# EAGLE design schematic (EAGLE 8.4.0)
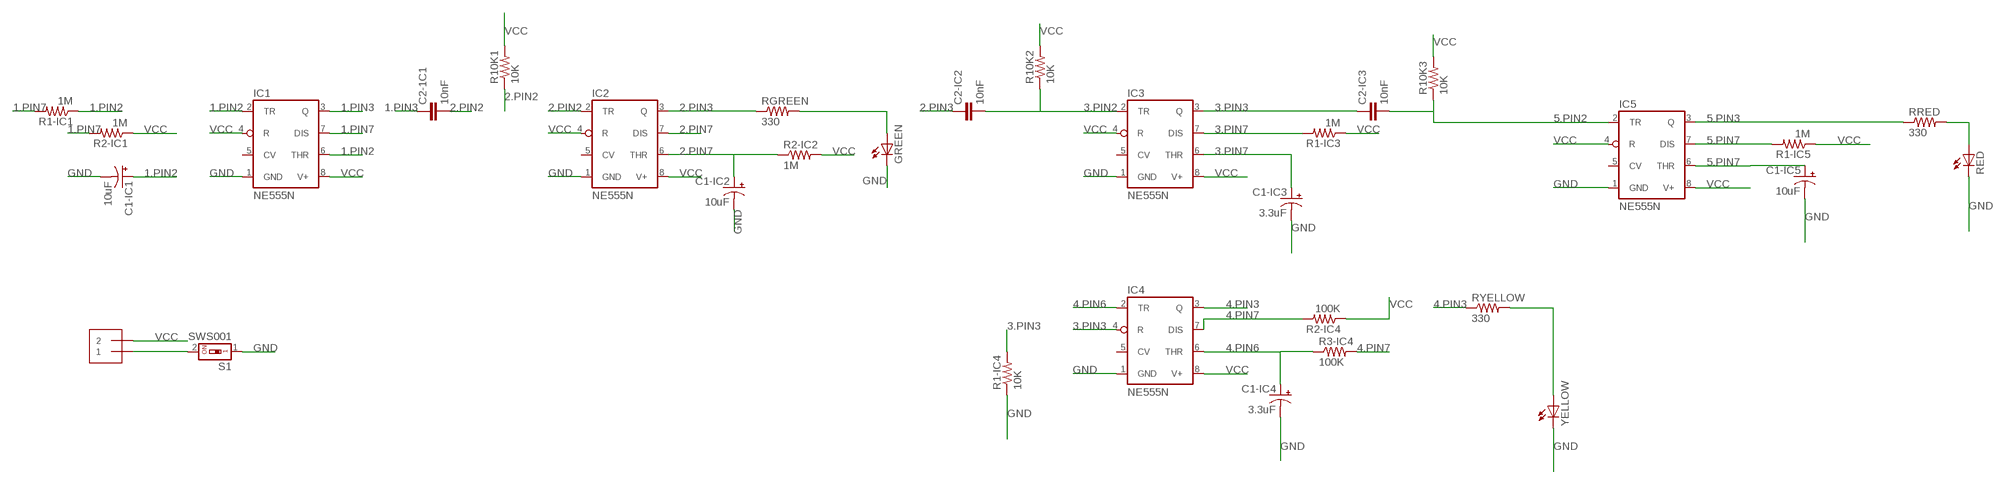
[diagram p0: schematic, sheet 1]

## Parts
C1-IC1  10uF  100UF-POLAR-RADIAL-2.5MM-25V-20%  [CPOL-RADIAL-2.5MM-6.5MM]
C1-IC2  10uF  100UF-POLAR-RADIAL-2.5MM-25V-20%  [CPOL-RADIAL-2.5MM-6.5MM]
C1-IC3  3.3uF  100UF-POLAR-RADIAL-2.5MM-25V-20%  [CPOL-RADIAL-2.5MM-6.5MM]
C1-IC4  3.3uF  100UF-POLAR-RADIAL-2.5MM-25V-20%  [CPOL-RADIAL-2.5MM-6.5MM]
C1-IC5  10uF  100UF-POLAR-RADIAL-2.5MM-25V-20%  [CPOL-RADIAL-2.5MM-6.5MM]
C2-1C1  10nF  10NF-0603-50V-10%  [0603]
C2-IC2  10nF  10NF-0603-50V-10%  [0603]
C2-IC3  10nF  10NF-0603-50V-10%  [0603]
GREEN  LED5MM  [LED5MM]
IC1  NE555N  [DIL08-ROUND]
IC2  NE555N  [DIL08-ROUND]
IC3  NE555N  [DIL08-ROUND]
IC4  NE555N  [DIL08-ROUND]
IC5  NE555N  [DIL08-ROUND]
J1  1X2-3.5MM  [1X2-3.5MM]
R1-IC1  1M  R-US_0204/7  [0204/7]
R1-IC3  1M  R-US_0204/7  [0204/7]
R1-IC4  10K  R-US_0204/7  [0204/7]
R1-IC5  1M  R-US_0204/7  [0204/7]
R2-IC1  1M  R-US_0204/7  [0204/7]
R2-IC2  1M  R-US_0204/7  [0204/7]
R2-IC4  100K  R-US_0204/7  [0204/7]
R3-IC4  100K  R-US_0204/7  [0204/7]
R10K1  10K  R-US_0204/7  [0204/7]
R10K2  10K  R-US_0204/7  [0204/7]
R10K3  10K  R-US_0204/7  [0204/7]
RED  LED5MM  [LED5MM]
RGREEN  330  R-US_0204/7  [0204/7]
RRED  330  R-US_0204/7  [0204/7]
RYELLOW  330  R-US_0204/7  [0204/7]
S1  SWS001  [SMS-001]
YELLOW  LED5MM  [LED5MM]

## Nets
1.PIN2: C1-IC1.1(+) IC1.2(TR) IC1.6(THR) R1-IC1.1
1.PIN3: C2-1C1.1 IC1.3(Q)
1.PIN7: IC1.7(DIS) R1-IC1.2 R2-IC1.2
2.PIN2: C2-1C1.2 IC2.2(TR) R10K1.1
2.PIN3: C2-IC2.1 IC2.3(Q) RGREEN.1
2.PIN7: C1-IC2.1(+) IC2.6(THR) IC2.7(DIS) R2-IC2.1
3.PIN2: C2-IC2.2 IC3.2(TR) R10K2.1
3.PIN3: C2-IC3.1 IC3.3(Q) IC4.4(R) R1-IC4.2
3.PIN7: C1-IC3.1(+) IC3.6(THR) IC3.7(DIS) R1-IC3.2
4.PIN3: IC4.3(Q) RYELLOW.1
4.PIN6: C1-IC4.1(+) IC4.2(TR) IC4.6(THR) R3-IC4.1
4.PIN7: IC4.7(DIS) R2-IC4.2 R3-IC4.2
5.PIN2: C2-IC3.2 IC5.2(TR) R10K3.1
5.PIN3: IC5.3(Q) RRED.1
5.PIN7: C1-IC5.1(+) IC5.6(THR) IC5.7(DIS) R1-IC5.2
GND: C1-IC1.2(-) C1-IC2.2(-) C1-IC3.2(-) C1-IC4.2(-) C1-IC5.2(-) GREEN.K(C) IC1.1(GND) IC2.1(GND) IC3.1(GND) IC4.1(GND) IC5.1(GND) R1-IC4.1 RED.K(C) S1.1 YELLOW.K(C)
GNDBAT: J1.1 S1.2
GREEN: GREEN.A RGREEN.2
RED: RED.A RRED.2
VCC: IC1.4(R) IC1.8(V+) IC2.4(R) IC2.8(V+) IC3.4(R) IC3.8(V+) IC4.8(V+) IC5.4(R) IC5.8(V+) J1.2 R1-IC3.1 R1-IC5.1 R2-IC1.1 R2-IC2.2 R2-IC4.1 R10K1.2 R10K2.2 R10K3.2
YELLOW: RYELLOW.2 YELLOW.A
Unconnected: IC1.5(CV) IC2.5(CV) IC3.5(CV) IC4.5(CV) IC5.5(CV)

## Library data of the parts
C1-IC1-C1-IC5 = SparkFun-Capacitors:100UF-POLAR: 100µF polarized capacitors A capacitor is a passive two-terminal electrical component used to store electrical energy temporarily in an electric field.; PROD_ID: CAP-08439; VALUE: 100uF
C2-1C1 C2-IC2 C2-IC3 = SparkFun-Capacitors:10NF: 0.01uF/10nF/10,000pF ceramic capacitors A capacitor is a passive two-terminal electrical component used to store electrical energy temporarily in an electric field. CAP-09321; PROD_ID: CAP-00867
GREEN RED YELLOW = adafruit:LED: LED OSRAM: - CHIPLED LG R971, LG N971, LY N971, LG Q971, LY Q971, LO R971, LY R971 LH N974, LH R974 LS Q976, LO Q976, LY Q976 LO Q996 - Hyper CHIPLED LW Q18S LB Q993, LB Q99A, LB R99A - SideLED LS A670, LO A670, LY A670, LG A670, LP A670 LB A673, LV A673, LT A673, LW A673 LH A674 LY A675 LS A676, LA A676, LO A676, LY A676, LW A676 LS A679, LY A679, LG A679 - Hyper Micro SIDELED® LS Y876, LA Y876, LO Y876, LY Y876 LT Y87S - SmartLED LW L88C, LW L88S LB L89C, LB L89S, LG L890 LS L89K, LO L89K, LY L89K LS L896, LA L896, LO L896, LY L896 - TOPLED LS T670, LO T670, LY T670, LG T670, LP T670 LSG T670, LSP T670, LSY T670, LOP T670, LYG T670 LG T671, LOG T671, LSG T671 LB T673, LV T673, LT T673, LW T673 LH T674 LS T676, LA T676, LO T676, LY T676, LB T676, LH T676, LSB T676, LW T676 LB T67C, LV T67C, LT T67C, LS T67K, LO T67K, LY T67K, LW E67C LS E67B, LA E67B, LO E67B, LY E67B, LB E67C, LV E67C, LT E67C LW T67C LS T679, LY T679, LG T679 LS T770, LO T770, LY T770, LG T770, LP T770 LB T773, LV T773, LT T773, LW T773 LH T774 LS E675, LA E675, LY E675, LS T675 LS T776, LA T776, LO T776, LY T776, LB T776 LHGB T686 LT T68C, LB T68C - Hyper Mini TOPLED® LB M676 - Mini TOPLED Santana® LG M470 LS M47K, LO M47K, LY M47K Source: http://www.osram.convergy.de/
IC1-IC5 = adafruit:*555: TIMER Changed DIP package to have round (not oval) pin pads http://www.ladyada.net/library/pcb/eaglelibrary.html
J1 = adafruit:1X2: 3.5mm Terminal block http://www.ladyada.net/library/pcb/eaglelibrary.html
R1-IC1 R1-IC3-R1-IC5 R2-IC1 R2-IC2 R2-IC4 R3-IC4 R10K1-R10K3 RGREEN RRED RYELLOW = adafruit:R-US_: RESISTOR, American symbol
S1 = smd-special:SWS001: SMD Dip Switch 1 pol.

## Net classes
0 default: width 0.65 mm, drill 0.3 mm, clearance 0.7 mm

## Board
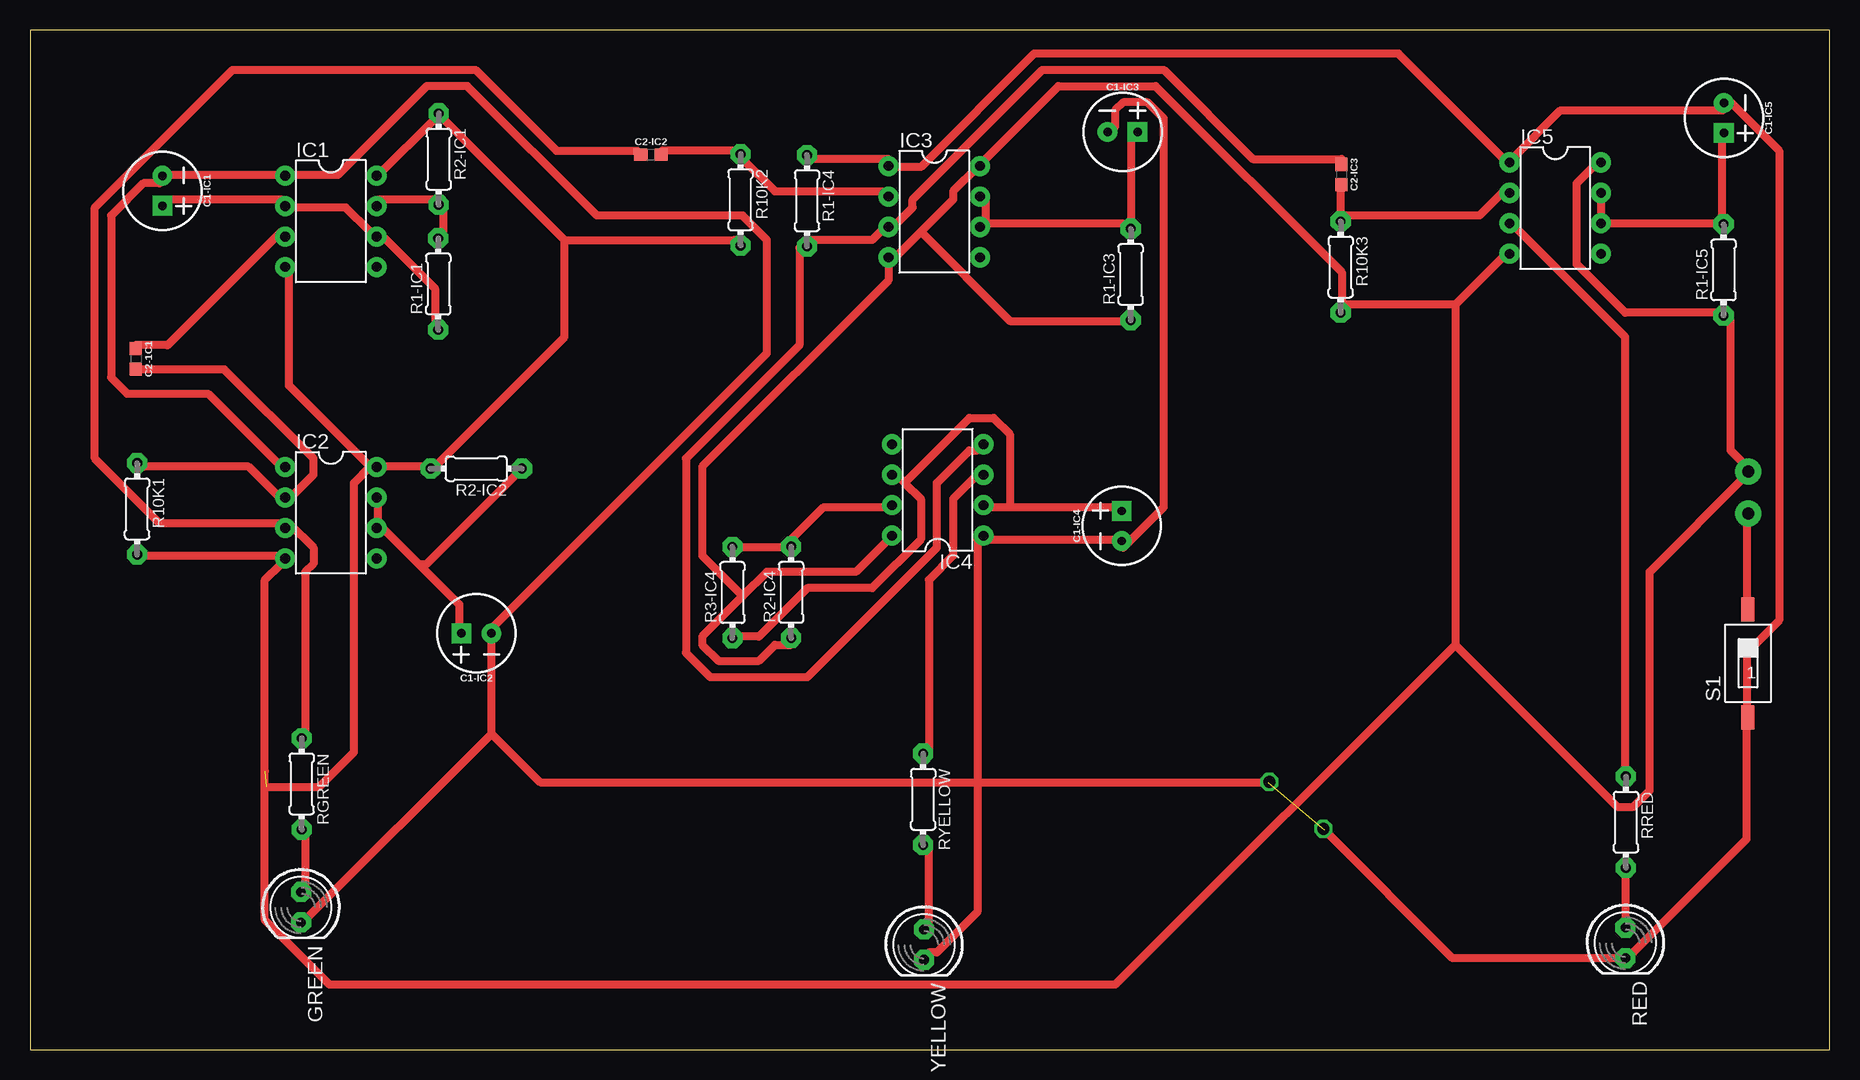
[diagram p1: board, top side]
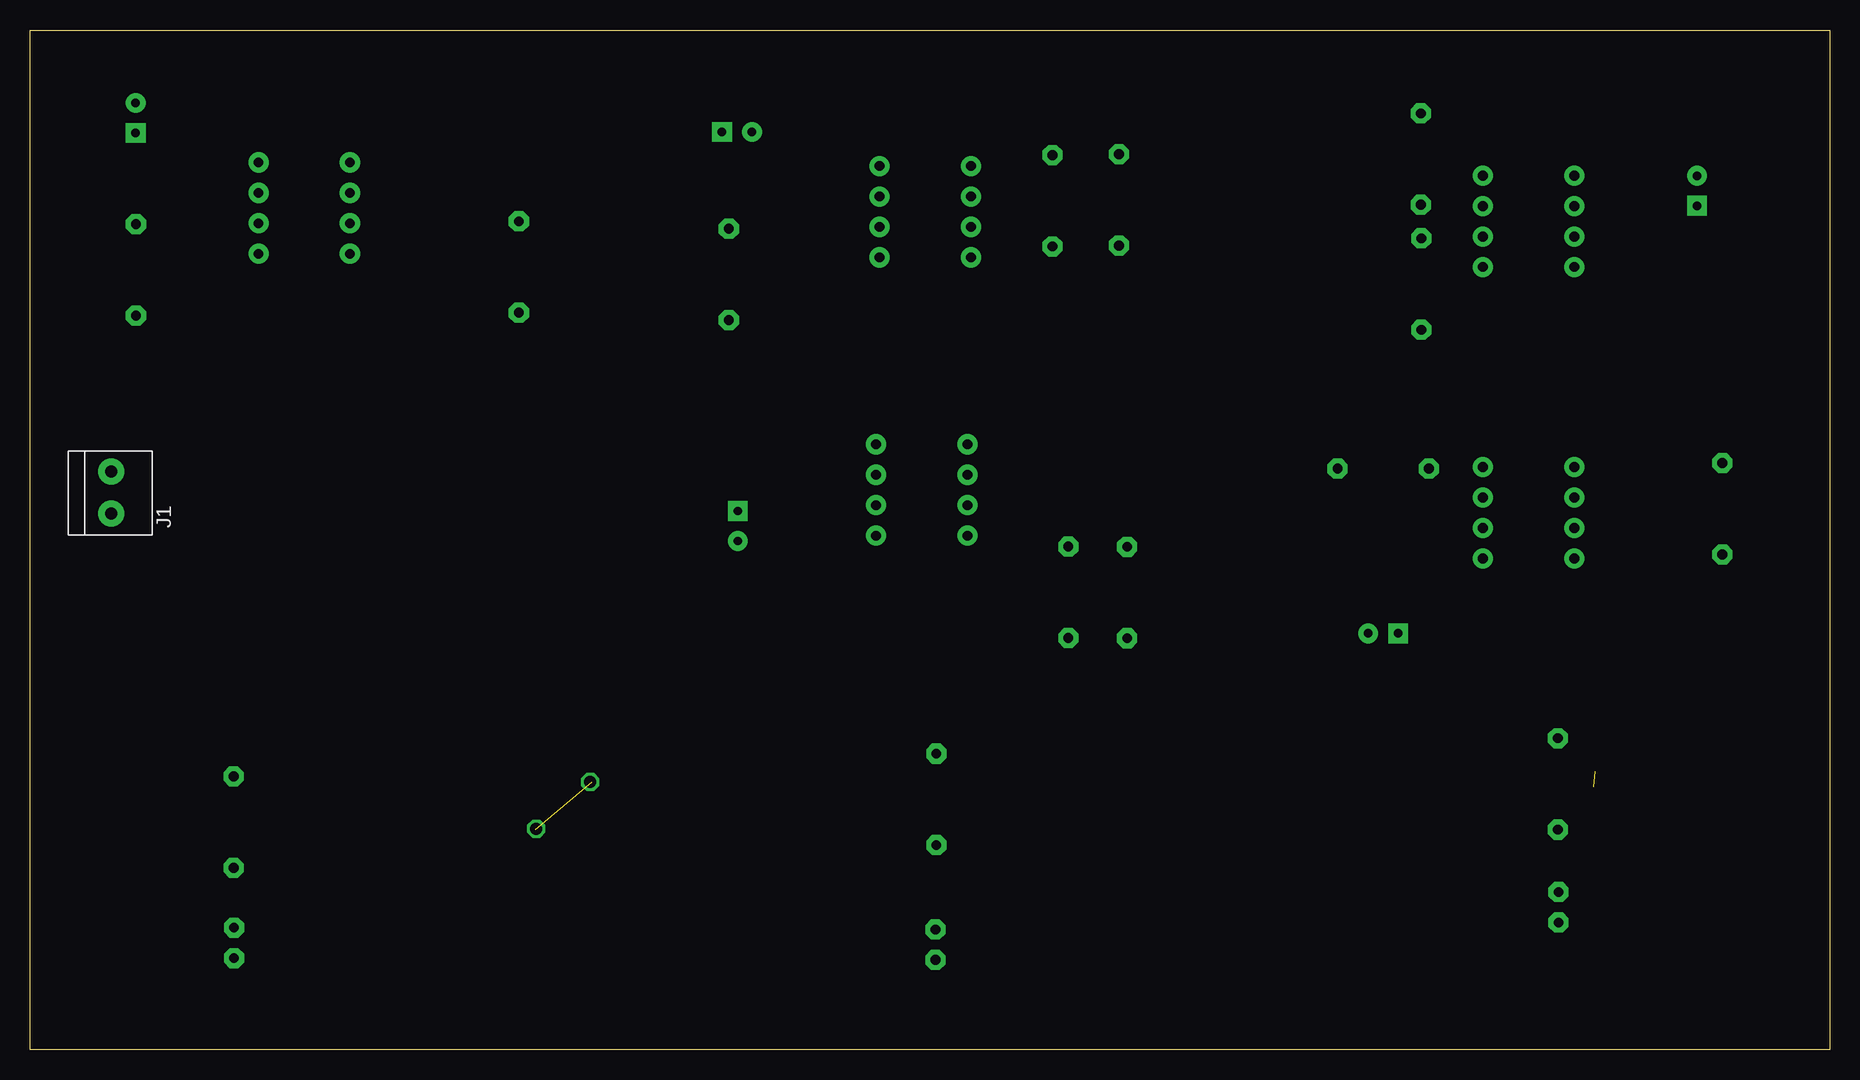
[diagram p2: board, bottom side, seen from below]

Size 150 x 85 mm. Coordinates in mm from the lower left corner, seen from the top.
Outline: 0,0 150,0 150,85 0,85 0,0
Copper layers (1*16): Top 0.035mm / dielectric 1.5mm / Bottom 0.035mm
Design rules "default": minimum track width 6mil, minimum drill 0.35mm, track to track 6mil, track to pad 6mil, pad to pad 6mil, via to via 6mil, smd to smd 6mil, copper to edge 40mil, drill to drill 6mil, minimum pad ring 10mil, minimum via ring 8mil, stop-mask expansion 4mil, vias tented up to drill 0mil, thermal gap 10mil

### Footprints (pad centres in the part's own frame; a part is rotated, then mirrored left to right if it is on the bottom)
CPOL-RADIAL-2.5MM-6.5MM = drill 0.7 pad 1.651 square: 1 1.25,0 | drill 0.7 pad 1.651: 2 -1.25,0
0603 = smd 1.1 x 1: 1 -0.85,0; 2 0.85,0
LED5MM = drill 0.813 pad 1.676 octagon: A -1.27,0; K 1.27,0
DIL08-ROUND = drill 0.813 pad 1.676: 1 -3.81,-3.81; 2 -1.27,-3.81; 3 1.27,-3.81; 4 3.81,-3.81; 5 3.81,3.81; 6 1.27,3.81; 7 -1.27,3.81; 8 -3.81,3.81
1X2-3.5MM = drill 1 pad 2.184: 1 1.8,0; 2 -1.7,0
0204/7 = drill 0.813 pad 1.676 octagon: 1 -3.81,0; 2 3.81,0
SMS-001 = smd 1.092 x 2.007: 1 0,-4.496; 2 0,4.496

### Placement (x,y rotation side)
C1-IC1  11.04,71.6 270 top
C1-IC2  37.21,34.7 180 top
C1-IC3  91.07,76.5 0 top
C1-IC4  91,43.65 90 top
C1-IC5  141.2,77.67 270 top
C2-1C1  8.83,57.58 270 top
C2-IC2  51.76,74.61 0 top
C2-IC3  109.31,72.95 270 top
GREEN  22.59,11.86 270 top
IC1  25.08,69.05 270 top
IC2  25.08,44.75 270 top
IC3  75.38,69.85 270 top
IC4  75.66,46.65 90 top
IC5  127.14,70.15 270 top
J1  143.23,46.48 270 bottom
R1-IC1  34.03,63.82 90 top
R1-IC3  91.75,64.62 90 top
R1-IC4  64.77,70.76 270 top
R1-IC5  141.17,65 90 top
R2-IC1  34.07,74.24 270 top
R2-IC2  37.2,48.43 180 top
R2-IC4  63.45,38.12 90 top
R3-IC4  58.55,38.1 90 top
R10K1  8.93,45.08 270 top
R10K2  59.23,70.84 270 top
R10K3  109.25,65.24 270 top
RED  132.99,8.89 270 top
RGREEN  22.65,22.14 270 top
RRED  133.03,18.96 270 top
RYELLOW  74.45,20.86 270 top
S1  143.2,32.2 0 top
YELLOW  74.53,8.74 270 top

### Tracks (layer width: path | path; a pad name or v marks a point on that pad's centre or on a via)
1.PIN2
  Top 0.65: C1-IC1.1 11.47,70.88 20.93,70.88 IC1.2 21.6,70.2 26.32,70.2 28.35,68.17 IC1.6 29.02,68.17 33.75,63.45 33.75,60.08 R1-IC1.1
1.PIN3
  Top 0.65: C2-1C1.1 8.78,58.73 11.47,58.73 20.93,68.17 IC1.3
1.PIN7
  Top 0.65: R1-IC1.2 34.42,68.17 34.42,70.2 R2-IC1.2 33.75,70.88 29.02,70.88 IC1.7
2.PIN2
  Top 0.65: C2-1C1.2 8.78,56.7 16.2,56.7 23.62,49.27 23.62,47.92 21.6,45.9 IC2.2 20.93,45.9 18.23,48.6 9.45,48.6 R10K1.1
2.PIN3
  Top 0.65: C2-IC2.1 50.62,74.92 43.88,74.92 37.12,81.67 16.88,81.67 5.4,70.2 5.4,49.27 10.8,43.88 20.93,43.88 IC2.3 21.6,43.88 23.62,41.85 23.62,40.5 22.95,39.83 22.95,26.32 RGREEN.1
2.PIN7
  Top 0.65: 29.02,43.88 32.4,40.5 | 32.4,40.5 35.77,37.12 35.77,35.1 C1-IC2.1 | 29.02,43.88 29.02,45.9 IC2.7 | 29.02,43.88 IC2.6 | 32.4,40.5 33.08,40.5 40.5,47.92 R2-IC2.1
3.PIN2
  Top 0.65: C2-IC2.2 52.65,74.92 58.73,74.92 R10K2.1 59.4,74.25 62.1,71.55 71.55,71.55 IC3.2
3.PIN3
  Top 0.65: C2-IC3.1 109.35,74.25 101.92,74.25 94.5,81.67 84.38,81.67 73.58,70.88 73.58,70.2 72.22,68.85 IC3.3 71.55,68.85 70.2,67.5 64.8,67.5 R1-IC4.2 64.12,66.83 64.12,58.73 54.67,49.27 54.67,33.08 56.7,31.05 64.8,31.05 75.6,41.85 75.6,47.25 78.3,49.95 78.97,49.95 IC4.4
3.PIN7
  Top 0.65: 79.65,68.85 79.65,70.88 IC3.7 | C1-IC3.1 91.8,76.28 91.8,68.85 R1-IC3.2 91.12,68.85 79.65,68.85 | 79.65,68.85 IC3.6
4.PIN3
  Top 0.65: RYELLOW.1 74.92,24.98 74.92,39.15 76.95,41.17 76.95,45.9 78.97,47.92 IC4.3
4.PIN6
  Top 0.65: 81.67,45.23 79.65,45.23 IC4.2 | 81.67,45.23 90.45,45.23 C1-IC4.1 | 72.9,47.25 72.22,47.92 IC4.6 | 72.9,47.25 74.25,45.9 74.25,42.52 70.2,38.48 64.8,38.48 60.75,34.42 58.73,34.42 R3-IC4.1 | 81.67,45.23 81.67,51.3 80.33,52.65 78.3,52.65 72.9,47.25
4.PIN7
  Top 0.65: R3-IC4.2 58.73,41.85 63.45,41.85 R2-IC4.2 63.45,42.52 66.15,45.23 71.55,45.23 IC4.7
5.PIN2
  Top 0.65: IC5.2 122.85,71.55 120.83,69.53 109.35,69.53 R10K3.1 109.25,72.04 C2-IC3.2
5.PIN3
  Top 0.65: IC5.3 123.53,68.85 132.97,59.4 132.97,22.95 RRED.1
5.PIN7
  Top 0.65: IC5.7 IC5.6 130.95,68.85 141.07,68.85 | 141.07,68.85 141.07,76.28 C1-IC5.1 | 141.07,68.85 R1-IC5.2
GND  (1 unrouted)
  Top 0.65: C1-IC3.2 90.45,76.95 90.45,78.3 91.12,78.97 93.15,78.97 94.5,77.62 94.5,45.23 91.12,41.85 C1-IC4.2 90.45,42.52 79.65,42.52 IC4.1 78.97,42.52 78.97,22.27 | 78.97,22.27 78.97,11.47 75.6,8.1 74.92,8.1 YELLOW.K | IC2.1 20.93,48.6 14.85,54.67 8.1,54.67 6.75,56.02 6.75,69.53 9.45,72.22 10.8,72.22 C1-IC1.2 11.47,72.9 20.93,72.9 IC1.1 21.6,72.9 25.65,72.9 33.08,80.33 36.45,80.33 47.25,69.53 59.4,69.53 61.42,67.5 61.42,58.05 38.48,35.1 C1-IC2.2 38.48,34.42 38.48,26.32 | 38.48,26.32 22.95,10.8 GREEN.K | 78.97,22.27 42.52,22.27 38.48,26.32 | R1-IC4.1 64.8,74.25 71.55,74.25 IC3.1 72.22,73.58 74.25,73.58 83.7,83.03 114.08,83.03 122.85,74.25 IC5.1 123.53,74.25 127.58,78.3 141.07,78.3 C1-IC5.2 141.75,78.97 145.8,74.92 145.8,35.77 143.1,33.08 143.1,28.35 S1.1 143.1,27.68 143.1,17.55 133.65,8.1 RED.K 118.58,7.62 107.9,18.3 | 78.97,22.27 103.17,22.27 103.2,22.3
GNDBAT
  Top 0.65: S1.2 143.1,37.12 143.1,44.55 J1.1
GREEN
  Top 0.65: GREEN.A 22.95,13.5 22.95,18.23 RGREEN.2
N$1  (via drill 1 pad 0.6)
  other vias: 103.3,22.3
N$2  (via drill 1 pad 0.6)
  other vias: 107.8,18.4
RED
  Top 0.65: RED.A 132.97,10.8 132.97,14.85 RRED.2
VCC  (1 unrouted)
  Top 0.65: IC1.8 29.02,72.9 33.75,77.62 R2-IC1.1 34.42,77.62 44.55,67.5 | 44.55,67.5 58.73,67.5 R10K2.2 | R10K1.2 9.45,41.17 20.93,41.17 IC2.4 20.93,40.5 19.57,39.15 19.57,23.2 19.57,10.8 24.98,5.4 90.45,5.4 118.8,33.75 | 28.35,48.6 21.6,55.35 21.6,64.8 IC1.4 | 28.35,48.6 27,47.25 27,24.8 24.1,21.9 19.68,21.9 19.57,21.8 | 28.35,48.6 IC2.8 29.02,48.6 33.08,48.6 R2-IC2.2 33.75,48.6 44.55,59.4 44.55,67.5 | IC5.8 130.95,73.58 130.28,73.58 128.93,72.22 128.93,65.47 132.97,61.42 141.07,61.42 R1-IC5.1 141.75,60.75 141.75,49.95 143.1,48.6 J1.2 143.1,47.92 135,39.83 135,21.6 133.65,20.25 132.3,20.25 118.8,33.75 | 59.4,37.8 61.42,39.83 68.85,39.83 71.55,42.52 IC4.8 | 59.4,37.8 56.02,34.42 56.02,33.75 57.38,32.4 60.75,32.4 62.1,33.75 63.45,33.75 R2-IC4.1 | 118.8,62.1 109.35,62.1 | 118.8,62.1 122.85,66.15 IC5.4 | 74.25,68.17 76.95,70.88 76.95,71.55 78.97,73.58 IC3.8 79.65,74.25 85.72,80.33 93.83,80.33 109.35,64.8 109.35,62.1 | 74.25,68.17 72.22,66.15 IC3.4 71.55,65.47 71.55,64.12 56.02,48.6 56.02,41.17 59.4,37.8 | 74.25,68.17 81.67,60.75 91.12,60.75 R1-IC3.1 | 109.35,62.1 R10K3.2 | 118.8,62.1 118.8,33.75
YELLOW
  Top 0.65: RYELLOW.2 74.92,16.88 74.92,10.12 YELLOW.A